# Altium schematic sheet MCU Power.SchDoc: MCU Power
size A4; Author: Miłosz Werner & Julia Rzepka; DrawnBy: Miłosz Werner; Organization: Wroclaw University of Science and Technology; Revision: 1.0; SheetNumber: 5; SheetTotal: 8
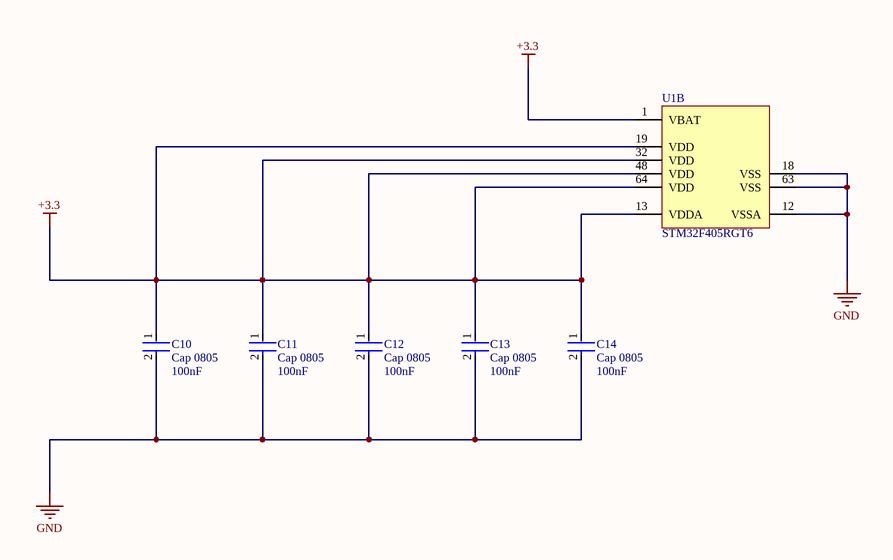
[diagram p0: MCU Power.SchDoc]

## Parts
C10  Cap 0805  value 100nF  [FP-GRM216-0_1-IPC_C]
C11  Cap 0805  value 100nF  [FP-GRM216-0_1-IPC_C]
C12  Cap 0805  value 100nF  [FP-GRM216-0_1-IPC_C]
C13  Cap 0805  value 100nF  [FP-GRM216-0_1-IPC_C]
C14  Cap 0805  value 100nF  [FP-GRM216-0_1-IPC_C]
U1  STM32F405RGT6  [STM-LQFP64_V]  (part B of 2)

## Nets
+3.3: C10.1 C11.1 C12.1 C13.1 C14.1 U1.1(VBAT) U1.13(VDDA) U1.19(VDD) U1.32(VDD) U1.48(VDD) U1.64(VDD)
GND: C10.2 C11.2 C12.2 C13.2 C14.2 U1.12(VSSA) U1.18(VSS) U1.63(VSS)

## Library data of the parts
C10-C14 = CMP-2007-00889-2: Capacitor; Mount: Surface Mount; Case/Package: 0805; Case Code (Imperial): 0805; Capacitance: 100nF
U1 = CMP-0243-00019-3: ARM Cortex-M4 32-bit MCU+FPU, 210 DMIPS, 1024 kB Flash, 192 kB Internal RAM, 51 I/Os, 64-pin LQFP, -40 to 85 degC, Tray; Manufacturer: STMicroelectronics; Supply Voltage(Vcc) min (V): 1.8; Supply Voltage(Vcc) max (V): 3.6; Internal RAM Size (kB): 192; I/Os (High Current): 51; D/A Converter: 2x12-bit; FLASH Size (Prog) (kB): 1024; Operating Frequency(F) (Processor speed) (MHz): 168; ComponentLink2Description: Datasheet; PackageVersion: Rev. 4, 06/2013; DatasheetVersion: Rev. 4; Core: ARM Cortex-M4; ComponentLink2URL: http://www.st.com/st-web-ui/static/active/en/resource/technical/document/datasheet/DM00037051.pdf; PackageReference: LQFP64; Packing: Tray; ComponentLink1Description: Manufacturer URL; ComponentLink3URL: http://www.st.com/st-web-ui/static/active/en/resource/technical/document/datasheet/DM00037051.pdf; ComponentLink3Description: Package Specification; Mounting Technology: Surface Mount; ComponentLink1URL: http://www.st.com/web/en/home.html; PackageDescription: 64-Pin Low Profile Quad Flat Package, 10 x 10 mm Body, 0.5 mm Pitch; PartNumber: STM32F405RGT6